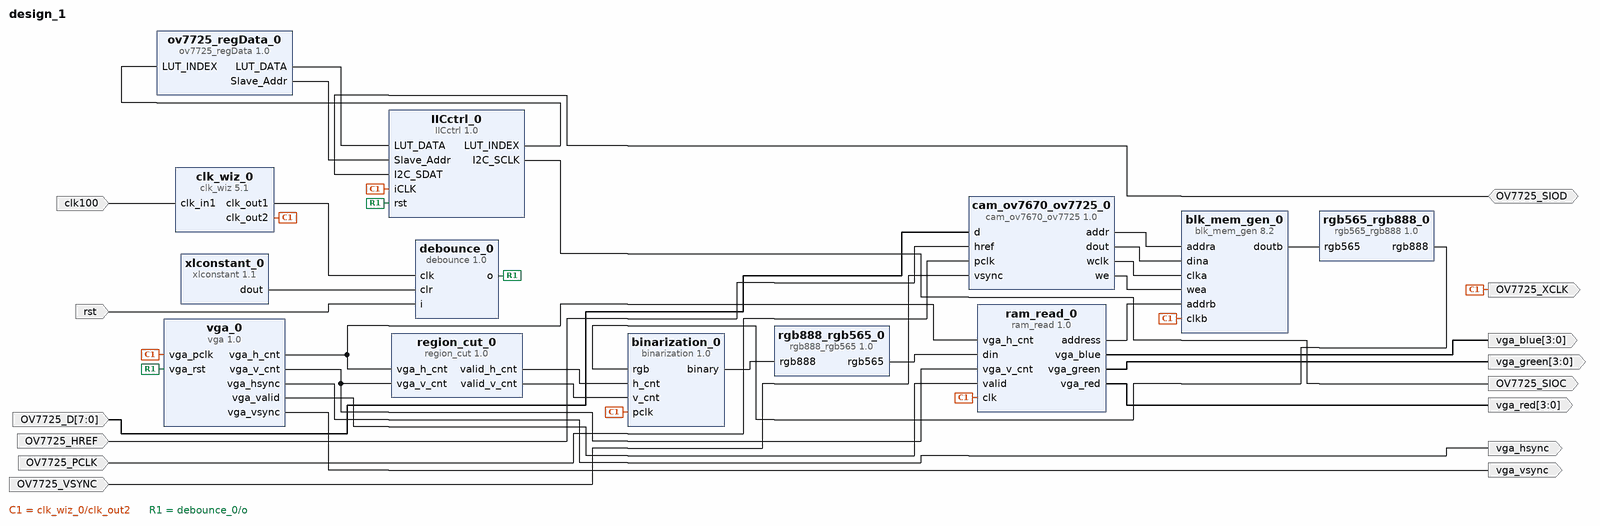
[diagram p0: block diagram of the top level]
# Vivado block design design_1, Vivado 2014.4
create_bd_design design_1

create_bd_port -dir I -from 7 -to 0 OV7725_D
create_bd_port -dir I OV7725_HREF
create_bd_port -dir I OV7725_PCLK
create_bd_port -dir O OV7725_SIOC
create_bd_port -dir IO OV7725_SIOD
create_bd_port -dir I OV7725_VSYNC
create_bd_port -dir O -type clk OV7725_XCLK
create_bd_port -dir I -type clk clk100
create_bd_port -dir I rst
create_bd_port -dir O -from 3 -to 0 vga_blue
create_bd_port -dir O -from 3 -to 0 vga_green
create_bd_port -dir O vga_hsync
create_bd_port -dir O -from 3 -to 0 vga_red
create_bd_port -dir O vga_vsync

create_bd_cell -type ip -vlnv xilinx.com:XUP:IICctrl:1.0 IICctrl_0
create_bd_cell -type ip -vlnv xilinx.com:XUP:binarization:1.0 binarization_0
create_bd_cell -type ip -vlnv xilinx.com:ip:blk_mem_gen:8.2 blk_mem_gen_0
set_property -dict [list \
  CONFIG.Memory_Type Simple_Dual_Port_RAM \
  CONFIG.Enable_32bit_Address false \
  CONFIG.Use_Byte_Write_Enable false \
  CONFIG.Write_Width_A 16 \
  CONFIG.Write_Depth_A 76800 \
  CONFIG.Operating_Mode_A NO_CHANGE \
  CONFIG.Enable_A Always_Enabled \
  CONFIG.Write_Width_B 16 \
  CONFIG.Read_Width_B 16 \
  CONFIG.Enable_B Always_Enabled \
  CONFIG.Register_PortB_Output_of_Memory_Primitives true \
  CONFIG.Port_B_Clock 100 \
  CONFIG.Port_B_Enable_Rate 100 \
  CONFIG.use_bram_block Stand_Alone \
] [get_bd_cells blk_mem_gen_0]
create_bd_cell -type ip -vlnv xilinx.com:XUP:cam_ov7670_ov7725:1.0 cam_ov7670_ov7725_0
create_bd_cell -type ip -vlnv xilinx.com:ip:clk_wiz:5.1 clk_wiz_0
set_property -dict [list \
  CONFIG.CLKOUT2_USED true \
  CONFIG.NUM_OUT_CLKS 2 \
  CONFIG.CLKOUT2_REQUESTED_OUT_FREQ 25.000 \
  CONFIG.USE_LOCKED false \
  CONFIG.USE_RESET false \
  CONFIG.CLKOUT2_JITTER 175.402 \
  CONFIG.CLKOUT2_PHASE_ERROR 98.575 \
] [get_bd_cells clk_wiz_0]
create_bd_cell -type ip -vlnv xilinx.com:XUP:debounce:1.0 debounce_0
create_bd_cell -type ip -vlnv xilinx.com:XUP:ov7725_regData:1.0 ov7725_regData_0
create_bd_cell -type ip -vlnv xilinx.com:XUP:ram_read:1.0 ram_read_0
create_bd_cell -type ip -vlnv xilinx.com:XUP:region_cut:1.0 region_cut_0
create_bd_cell -type ip -vlnv xilinx.com:XUP:rgb565_rgb888:1.0 rgb565_rgb888_0
create_bd_cell -type ip -vlnv xilinx.com:XUP:rgb888_rgb565:1.0 rgb888_rgb565_0
create_bd_cell -type ip -vlnv xilinx.com:XUP:vga:1.0 vga_0
create_bd_cell -type ip -vlnv xilinx.com:ip:xlconstant:1.1 xlconstant_0
set_property -dict {CONFIG.CONST_VAL 0} [get_bd_cells xlconstant_0]

# ---- connections ----

connect_bd_net [get_bd_pins IICctrl_0/I2C_SCLK] [get_bd_ports OV7725_SIOC]
connect_bd_net [get_bd_pins IICctrl_0/LUT_INDEX] [get_bd_pins ov7725_regData_0/LUT_INDEX]
connect_bd_net [get_bd_ports OV7725_SIOD] [get_bd_pins IICctrl_0/I2C_SDAT]
connect_bd_net [get_bd_pins binarization_0/binary] [get_bd_pins rgb888_rgb565_0/rgb888]
connect_bd_net [get_bd_pins blk_mem_gen_0/doutb] [get_bd_pins rgb565_rgb888_0/rgb565]
connect_bd_net [get_bd_pins cam_ov7670_ov7725_0/addr] [get_bd_pins blk_mem_gen_0/addra]
connect_bd_net [get_bd_pins cam_ov7670_ov7725_0/dout] [get_bd_pins blk_mem_gen_0/dina]
connect_bd_net [get_bd_pins cam_ov7670_ov7725_0/wclk] [get_bd_pins blk_mem_gen_0/clka]
connect_bd_net [get_bd_pins cam_ov7670_ov7725_0/we] [get_bd_pins blk_mem_gen_0/wea]
connect_bd_net -net clk_in1_1 [get_bd_ports clk100] [get_bd_pins clk_wiz_0/clk_in1]
connect_bd_net [get_bd_pins clk_wiz_0/clk_out1] [get_bd_pins debounce_0/clk]
connect_bd_net [get_bd_pins clk_wiz_0/clk_out2] \
  [get_bd_ports OV7725_XCLK] [get_bd_pins IICctrl_0/iCLK] [get_bd_pins binarization_0/pclk] [get_bd_pins blk_mem_gen_0/clkb] \
  [get_bd_pins ram_read_0/clk] [get_bd_pins vga_0/vga_pclk]
connect_bd_net -net d_1 [get_bd_ports OV7725_D] [get_bd_pins cam_ov7670_ov7725_0/d]
connect_bd_net [get_bd_pins debounce_0/o] [get_bd_pins IICctrl_0/rst] [get_bd_pins vga_0/vga_rst]
connect_bd_net -net href_1 [get_bd_ports OV7725_HREF] [get_bd_pins cam_ov7670_ov7725_0/href]
connect_bd_net -net i_1 [get_bd_ports rst] [get_bd_pins debounce_0/i]
connect_bd_net [get_bd_pins ov7725_regData_0/LUT_DATA] [get_bd_pins IICctrl_0/LUT_DATA]
connect_bd_net [get_bd_pins ov7725_regData_0/Slave_Addr] [get_bd_pins IICctrl_0/Slave_Addr]
connect_bd_net -net pclk_1 [get_bd_ports OV7725_PCLK] [get_bd_pins cam_ov7670_ov7725_0/pclk]
connect_bd_net [get_bd_pins ram_read_0/address] [get_bd_pins blk_mem_gen_0/addrb]
connect_bd_net [get_bd_pins ram_read_0/vga_blue] [get_bd_ports vga_blue]
connect_bd_net [get_bd_pins ram_read_0/vga_green] [get_bd_ports vga_green]
connect_bd_net [get_bd_pins ram_read_0/vga_red] [get_bd_ports vga_red]
connect_bd_net [get_bd_pins region_cut_0/valid_h_cnt] [get_bd_pins binarization_0/h_cnt]
connect_bd_net [get_bd_pins region_cut_0/valid_v_cnt] [get_bd_pins binarization_0/v_cnt]
connect_bd_net [get_bd_pins rgb565_rgb888_0/rgb888] [get_bd_pins binarization_0/rgb]
connect_bd_net [get_bd_pins rgb888_rgb565_0/rgb565] [get_bd_pins ram_read_0/din]
connect_bd_net [get_bd_pins vga_0/vga_h_cnt] [get_bd_pins ram_read_0/vga_h_cnt] [get_bd_pins region_cut_0/vga_h_cnt]
connect_bd_net [get_bd_pins vga_0/vga_hsync] [get_bd_ports vga_hsync]
connect_bd_net [get_bd_pins vga_0/vga_v_cnt] [get_bd_pins ram_read_0/vga_v_cnt] [get_bd_pins region_cut_0/vga_v_cnt]
connect_bd_net [get_bd_pins vga_0/vga_valid] [get_bd_pins ram_read_0/valid]
connect_bd_net [get_bd_pins vga_0/vga_vsync] [get_bd_ports vga_vsync]
connect_bd_net -net vsync_1 [get_bd_ports OV7725_VSYNC] [get_bd_pins cam_ov7670_ov7725_0/vsync]
connect_bd_net [get_bd_pins xlconstant_0/dout] [get_bd_pins debounce_0/clr]

validate_bd_design
save_bd_design
